# Altium schematic sheet P17 POWER2.SchDoc
size 420 x 297 mm
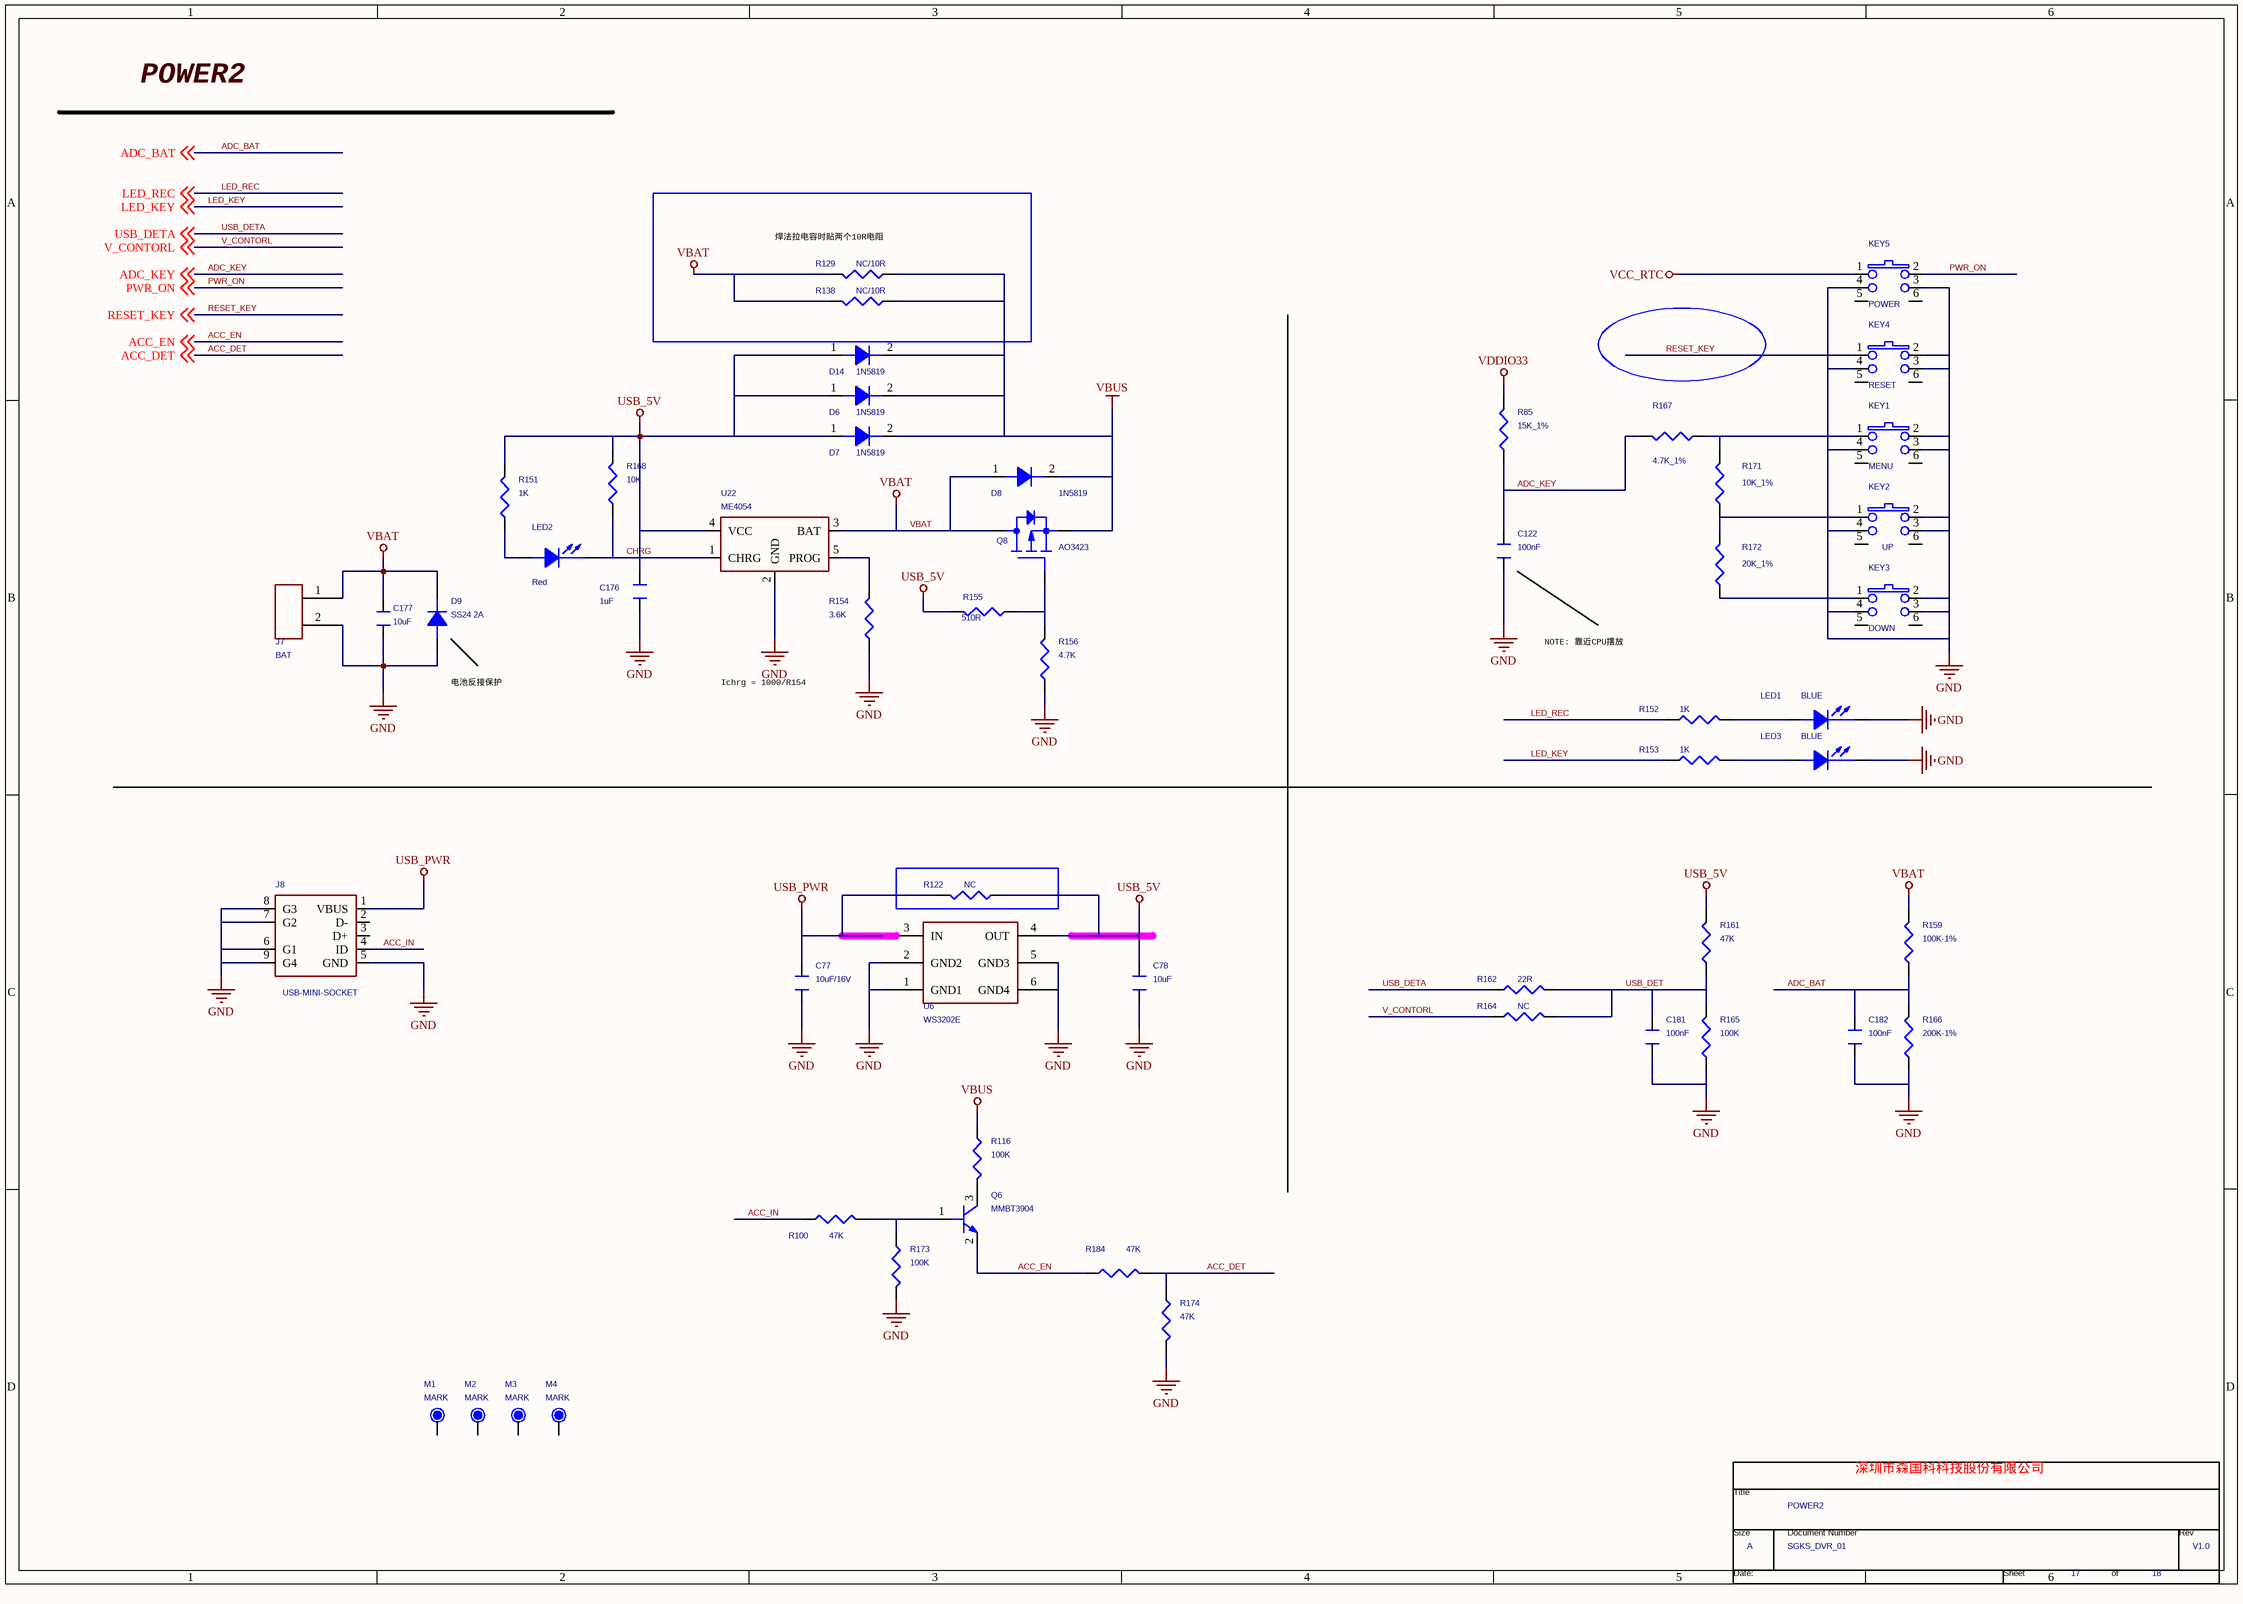
[diagram p0: P17 POWER2.SchDoc]

## Parts
*  Page Count: 18  Page Number: 17  Page Size: A  Title: POWER2  RevCode: V1.0  Doc: SGKS_DVR_01  (hidden comment: TitleBlock0)  (graphical)
C77  10uF/16V  [C0805]
C78  10uF  [C0805]
C122  100nF  [C0402]
C176  1uF  [C0402]
C177  10uF  [C0603]
C181  100nF  [C0402]
C182  100nF  [C0402]
D6  1N5819  [SOD-123]
D7  1N5819  [SOD-123]
D8  1N5819  [SOD-123]
D9  SS24 2A  [SOD-123]
D14  1N5819  [SOD-123]
J7  BAT  [CON2P254]
J8  USB-MINI-SOCKET  [USB_MINI_AB]
KEY1  MENU  [button]
KEY2  UP  [button]
KEY3  DOWN  [button]
KEY4  RESET  [button]
KEY5  POWER  [button]
LED1  BLUE  [LED-0603]
LED2  Red  [LED-0603]
LED3  BLUE  [LED-0603]
M1  MARK  [TP/SMD/D1.0]
M2  MARK  [TP/SMD/D1.0]
M3  MARK  [TP/SMD/D1.0]
M4  MARK  [TP/SMD/D1.0]
Q6  MMBT3904  [SOT-23]
Q8  AO3423  [SOT-23]
R85  15K_1%  [R0402]
R100  47K  [R0603/SMD]
R116  100K  [R0603/SMD]
R122  NC  [R0603]
R129  NC/10R  [R0603]
R138  NC/10R  [R0603]
R151  1K  [R0402]
R152  1K  [R0603/SMD]
R153  1K  [R0603/SMD]
R154  3.6K  [R0402]
R155  510R  [R0402]
R156  4.7K  [R0402]
R159  100K-1%  [R0402]
R161  47K  [R0402]
R162  22R  [R0603/SMD]
R164  NC  [R0603/SMD]
R165  100K  [R0402]
R166  200K-1%  [R0402]
R167  4.7K_1%  [R0603/SMD]
R168  10K  [R0402]
R171  10K_1%  [R0603/SMD]
R172  20K_1%  [R0603/SMD]
R173  100K  [R0603/SMD]
R174  47K  [R0603/SMD]
R184  47K  [R0603/SMD]
U6  WS3202E  [SOT23-6]
U22  ME4054  [SOT23-6]

## Blocks framed on the sheet
焊法拉电容时贴两个10R电阻: R129 R138

## Nets
GND: C77.1 C78.1 C122.1 C176.1 C177.1 C181.1 C182.1 D9.1(A) J7.2 J8.5(GND) J8.6(G1) J8.7(G2) J8.8(G3) J8.9(G4) KEY1.2 KEY1.3 KEY1.4 KEY2.2 KEY2.3 KEY2.4 KEY3.2 KEY3.3 KEY3.4 KEY4.2 KEY4.3 KEY4.4 KEY5.3 KEY5.4 LED1.2(CATHODE) LED3.2(CATHODE) R154.1 R156.1 R165.2 R166.2 R173.2 R174.2 U6.1(GND1) U6.2(GND2) U6.5(GND3) U6.6(GND4) U22.2(GND)
USB_5V: C78.2 C176.2 D6.1(A) D7.1(A) D14.1(A) R122.1 R151.2 R155.2 R161.1 R168.2 U6.4(OUT) U22.4(VCC)
USB_PWR: C77.2 J8.1(VBUS) R122.2 U6.3(IN)
VBAT: C177.2 D8.1(A) D9.2(K) J7.1 Q8.3(DRAIN) R129.2 R138.2 R159.1 U22.3(BAT)
VBUS: D6.2(K) D7.2(K) D8.2(K) D14.2(K) Q8.2(SOURCE) R116.1 R129.1 R138.1
VCC_RTC: KEY5.1
VDDIO33: R85.1
ACC_DET: R174.1 R184.2 ; off-sheet ACC_DET
ACC_EN: Q6.2(E) R184.1 ; off-sheet ACC_EN
ACC_IN: J8.4(ID) R100.1
ADC_BAT: C182.2 R159.2 R166.1 ; off-sheet ADC_BAT
ADC_KEY: C122.2 R85.2 R167.2 ; off-sheet ADC_KEY
CHRG: LED2.2(CATHODE) R168.1 U22.1(CHRG)
LED_KEY: R153.1 ; off-sheet LED_KEY
LED_REC: R152.1 ; off-sheet LED_REC
PWR_ON: KEY5.2 ; off-sheet PWR_ON
RESET_KEY: KEY4.1 ; off-sheet RESET_KEY
USB_DET: C181.2 R161.2 R162.2 R164.2 R165.1
USB_DETA: R162.1 ; off-sheet USB_DETA
V_CONTORL: R164.1 ; off-sheet V_CONTORL
NetKEY1_1: KEY1.1 R167.1 R171.2
NetKEY2_1: KEY2.1 R171.1 R172.2
NetKEY3_1: KEY3.1 R172.1
NetLED1_1: LED1.1(ANODE) R152.2
NetLED2_1: LED2.1(ANODE) R151.1
NetLED3_1: LED3.1(ANODE) R153.2
NetQ6_1: Q6.1(B) R100.2 R173.1
NetQ6_3: Q6.3(C) R116.2
NetQ8_1: Q8.1(GATE) R155.1 R156.2
NetR154_2: R154.2 U22.5(PROG)

Not connected (* = marked no-connect by the designer): J8 2(D-) 3(D+); KEY1 5 6; KEY2 5 6; KEY3 5 6; KEY4 5 6; KEY5 5 6; M1 1; M2 1; M3 1; M4 1

## Notes on the sheet
- POWER2
- NOTE: 靠近CPU摆放
- (near D9) 电池反接保护
- Ichrg = 1000/R154
- 深圳市森国科科技股份有限公司
- (in symbol TitleBlock0) Title; Size; Document Number; Rev; Date:; Sheet; of

## Library data of the parts
C77 C78 = CAPACITOR_0_Dup4: ROOM: PMU; PAGE: 1
C122 = CAPACITOR_0_Dup4: PAGE: 1; ROOM: PMU
C176 C177 C181 C182 = CAPACITOR: PAGE: 1
D6-D8 D14 = DIODE_0: 二极管
D9 = DIODE
J7 = CON3_0
J8 = USB_MINI_SOCKET_2
KEY1-KEY5 = button_1: Button; FPLIST: BUTTON,KEY; Part Number: Button; Part Type: 轻触按键
LED1-LED3 = LED
M1-M4 = TP_0: Part Description: Test Point; Type: NC
Q6 = NPN
Q8 = PMOS
R85 R159 R161 R165 R166 = RESISTOR_Dup2
R100 R116 R173 R174 R184 = RES/SMD_1: Part Description: Chip Resistor; Type: 贴片电阻
R122 R129 R138 R151 R154-R156 R168 = R_Dup1
R152 R153 R162 R164 R167 R171 R172 = RES/SMD_0: Part Description: Chip Resistor
U6 = AP3031_0: Page: 10
U22 = RT9266PE_0_Dup1
* = TitleBlock0: Page Create Date: March  8, 1995